# EAGLE schematic ProgrammableOLED (EAGLE 7.3.0)
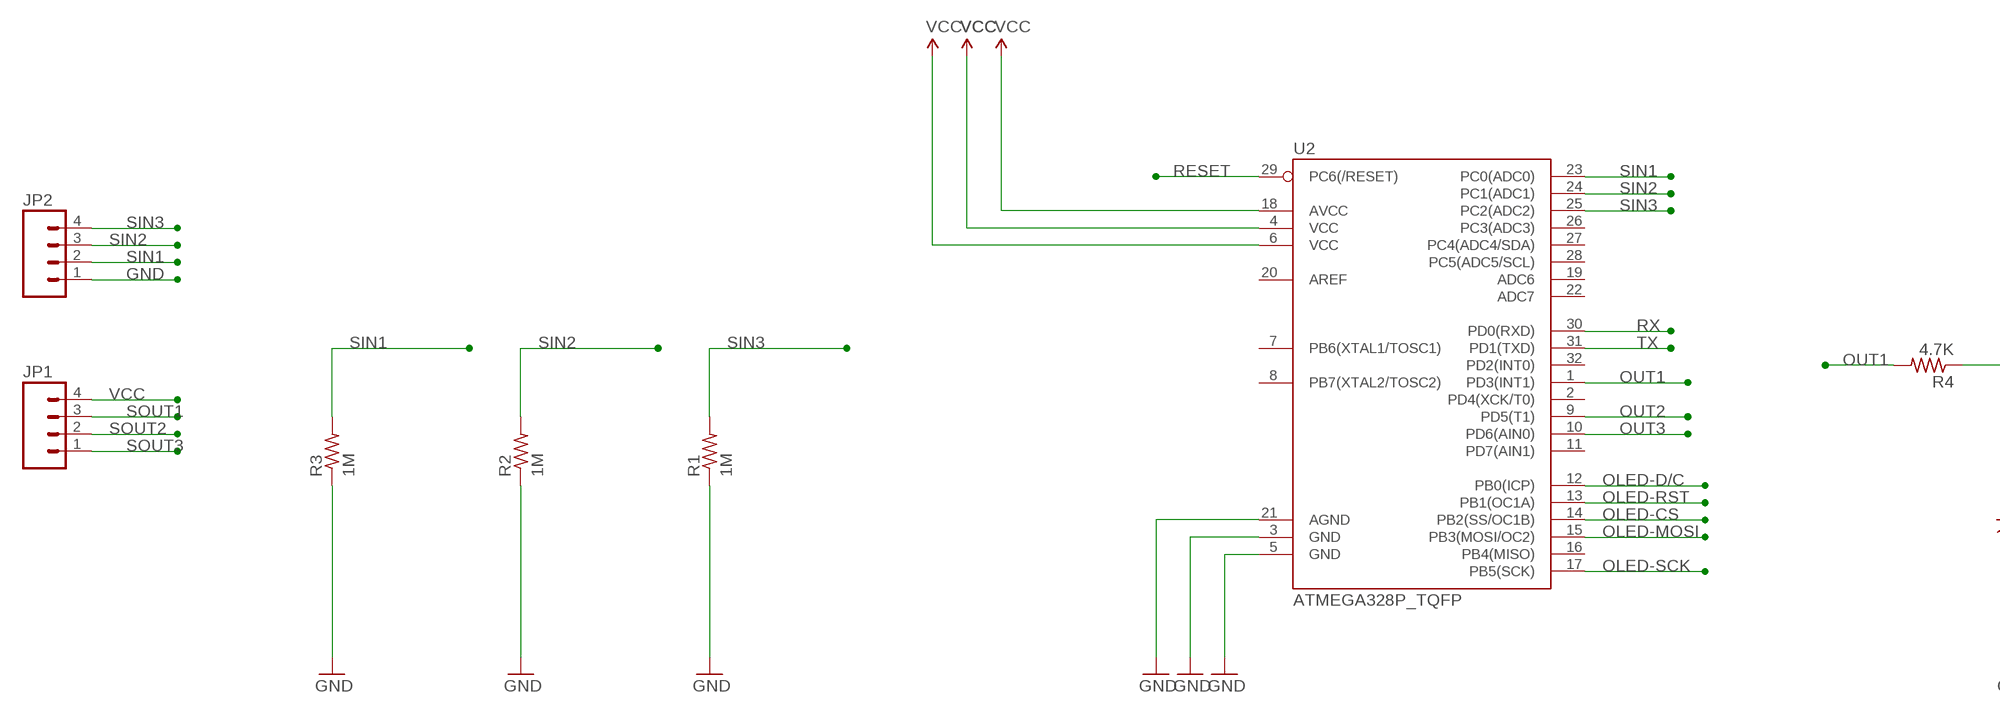
[diagram p0: schematic, sheet 1, part 1 of 2]
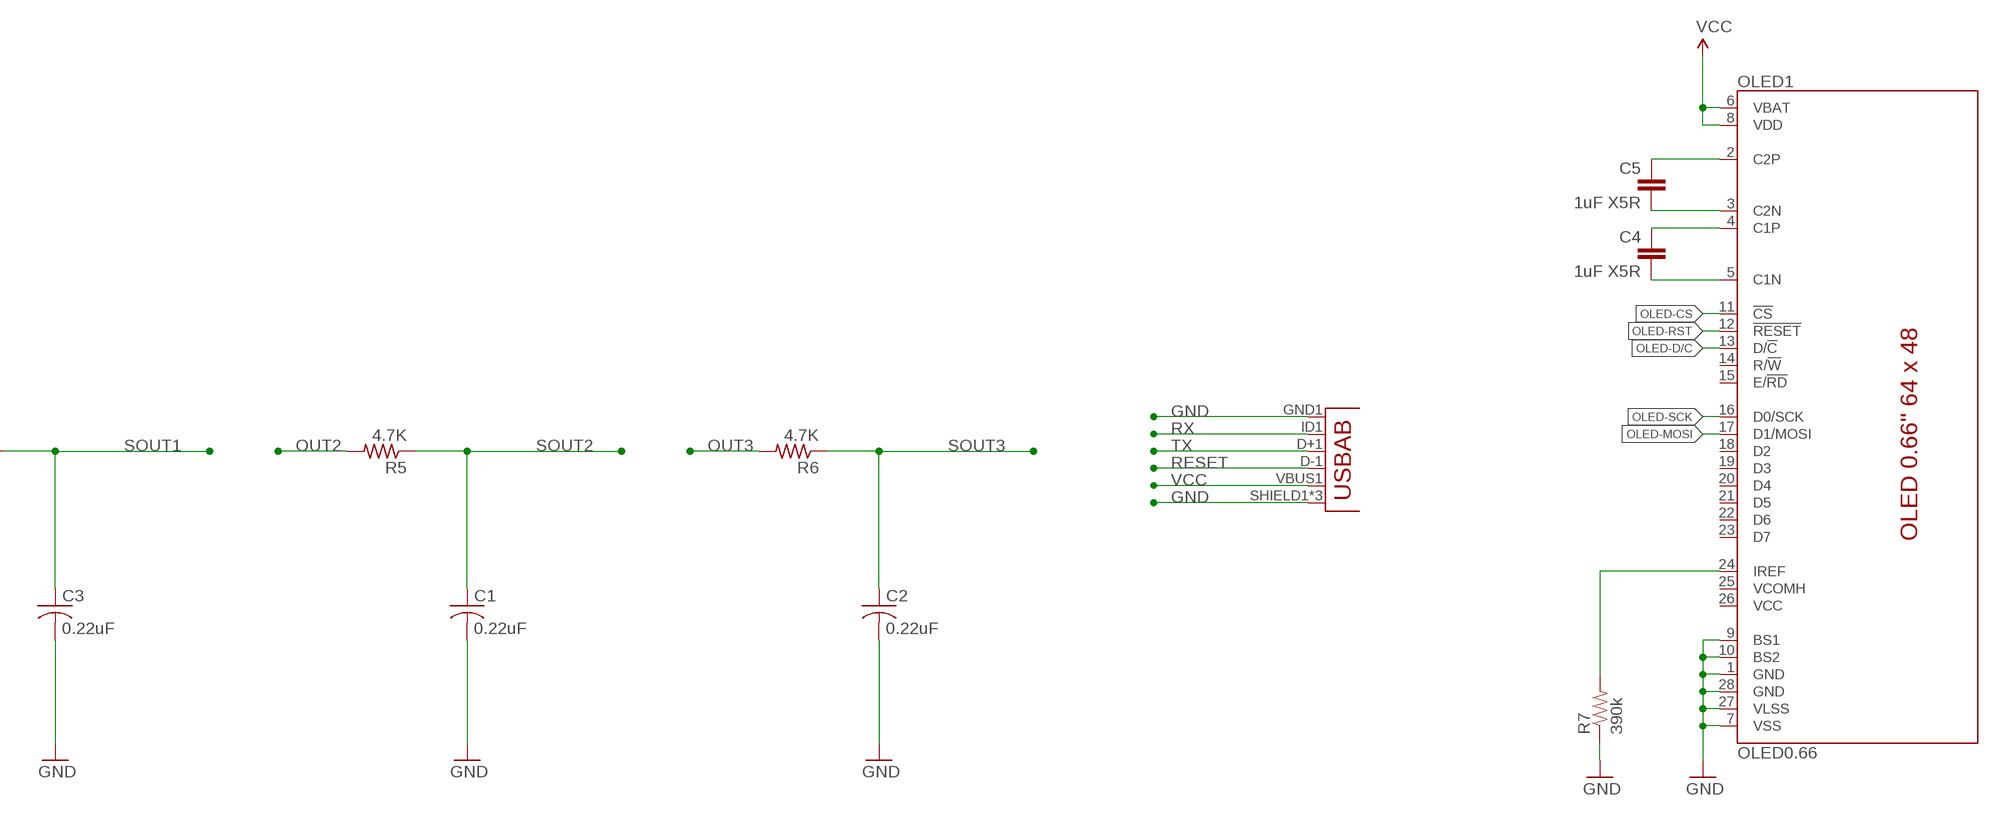
[diagram p1: schematic, sheet 1, part 2 of 2]

## Parts
C1  0.22uF  C-USC0603  [C0603]
C2  0.22uF  C-USC0603  [C0603]
C3  0.22uF  C-USC0603  [C0603]
C4  1uF X5R  CAP0805  [0805]
C5  1uF X5R  CAP0805  [0805]
JP1  M04PTH  [1X04]
JP2  M04PTH  [1X04]
JP5  USB-ABCONN-11794  [USB-AB-MICRO-SMD_V03]
OLED1  OLED0.66  [OLED-0.66-64X48]
R1  1M  R-US_R0603  [R0603]
R2  1M  R-US_R0603  [R0603]
R3  1M  R-US_R0603  [R0603]
R4  4.7K  R-US_R0603  [R0603]
R5  4.7K  R-US_R0603  [R0603]
R6  4.7K  R-US_R0603  [R0603]
R7  390k  RESISTOR0603-RES  [0603-RES]
U2  ATMEGA328P_TQFP  [TQFP32-08]

## Nets
C1N: C4.2 OLED1.5(C1N)
C1P: C4.1 OLED1.4(C1P)
C2N: C5.2 OLED1.3(C2N)
C2P: C5.1 OLED1.2(C2P)
GND: C1.2 C2.2 C3.2 JP2.1 JP5.GND1(GND) JP5.SHIELD1(SHIELD) JP5.SHIELD2(SHIELD) JP5.SHIELD3(SHIELD) OLED1.1(GND) OLED1.7(VSS) OLED1.9(BS1) OLED1.10(BS2) OLED1.27(VLSS) OLED1.28(GND) R1.1 R2.1 R3.1 R7.1 U2.3(GND) U2.5(GND) U2.21(AGND)
IREF: OLED1.24(IREF) R7.2
OLED-CS: OLED1.11(!CS!) U2.14(PB2(SS/OC1B))
OLED-D/C: OLED1.13(D/!C!) U2.12(PB0(ICP))
OLED-MOSI: OLED1.17(D1/MOSI) U2.15(PB3(MOSI/OC2))
OLED-RST: OLED1.12(!RESET!) U2.13(PB1(OC1A))
OLED-SCK: OLED1.16(D0/SCK) U2.17(PB5(SCK))
OUT1: R4.2 U2.1(PD3(INT1))
OUT2: R5.2 U2.9(PD5(T1))
OUT3: R6.2 U2.10(PD6(AIN0))
RESET: JP5.D-1(D-) U2.29(PC6(/RESET))
RX: JP5.ID1(USBID) U2.30(PD0(RXD))
SIN1: JP2.2 R3.2 U2.23(PC0(ADC0))
SIN2: JP2.3 R2.2 U2.24(PC1(ADC1))
SIN3: JP2.4 R1.2 U2.25(PC2(ADC2))
SOUT1: C3.1 JP1.3 R4.1
SOUT2: C1.1 JP1.2 R5.1
SOUT3: C2.1 JP1.1 R6.1
TX: JP5.D+1(D+) U2.31(PD1(TXD))
VCC: JP1.4 JP5.VBUS1(VBUS) OLED1.6(VBAT) OLED1.8(VDD) U2.4(VCC) U2.6(VCC) U2.18(AVCC)
Unconnected: OLED1.14(R/!W!) OLED1.15(E/!RD!) OLED1.18(D2) OLED1.19(D3) OLED1.20(D4) OLED1.21(D5) OLED1.22(D6) OLED1.23(D7) OLED1.25(VCOMH) OLED1.26(VCC) U2.2(PD4(XCK/T0)) U2.7(PB6(XTAL1/TOSC1)) U2.8(PB7(XTAL2/TOSC2)) U2.11(PD7(AIN1)) U2.16(PB4(MISO)) U2.19(ADC6) U2.20(AREF) U2.22(ADC7) U2.26(PC3(ADC3)) U2.27(PC4(ADC4/SDA)) U2.28(PC5(ADC5/SCL)) U2.32(PD2(INT0))

## Library data of the parts
C1-C3 = adafruit:C-US: CAPACITOR, American symbol
C4 C5 = SparkFun-Passives:CAP: Capacitor Standard 0603 ceramic capacitor, and 0.1" leaded capacitor.
JP1 JP2 = SparkFun-Connectors:M04: Header 4 Standard 4-pin 0.1" header. Use with straight break away headers (SKU : PRT-00116), right angle break away headers (PRT-00553), swiss pins (PRT-00743), machine pins (PRT-00117), and female headers (PRT-00115). Molex polarized connector foot print use with SKU : PRT-08231 with associated crimp pins and housings. 1MM SMD Version SKU: PRT-10208
JP5 = SparkFun-Connectors:USB-AB: This is a USB AB connector that is compatible with USB OTG. i.e. this connector can serve as a host or device; PROD_ID: CONN-11794
OLED1 = microView-temp:OLED0.66
R1-R6 = adafruit:R-US_: RESISTOR, American symbol
R7 = SparkFun-Passives:RESISTOR: Resistor Basic schematic elements and footprints for 0603, 1206, and PTH resistors.
U2 = SparkFun-DigitalIC:ATMEGA328P_TQFP; PROD_ID: IC-09069